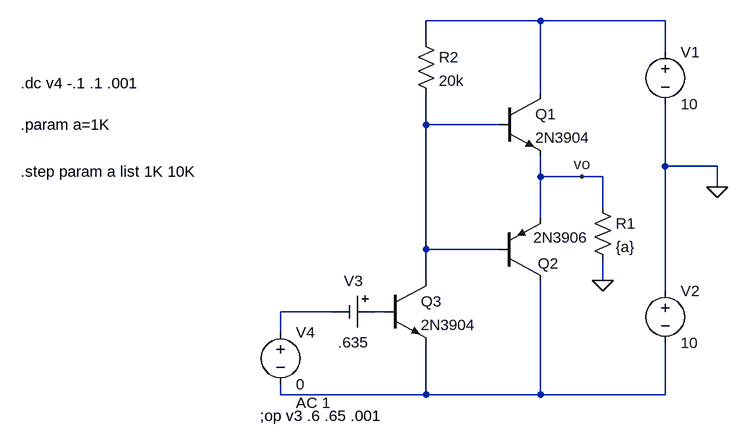
[diagram p0: schematic teoria7.asc]
teoria7.asc, the LTspice schematic file:
Version 4
SHEET 1 1092 680
WIRE 256 -32 80 -32
WIRE 448 -32 256 -32
WIRE 80 0 80 -32
WIRE 448 16 448 -32
WIRE 256 80 256 -32
WIRE 80 128 80 80
WIRE 192 128 80 128
WIRE 448 192 448 96
WIRE 528 192 448 192
WIRE 256 208 256 176
WIRE 320 208 256 208
WIRE 352 208 320 208
WIRE 528 224 528 192
WIRE 352 256 352 208
WIRE 256 272 256 208
WIRE 80 320 80 128
WIRE 192 320 80 320
WIRE 80 368 80 320
WIRE 352 368 352 336
WIRE 448 384 448 192
WIRE -64 416 -144 416
WIRE 16 416 0 416
WIRE -144 448 -144 416
WIRE -144 544 -144 528
WIRE 80 544 80 464
WIRE 80 544 -144 544
WIRE 256 544 256 368
WIRE 256 544 80 544
WIRE 448 544 448 464
WIRE 448 544 256 544
FLAG 352 368 0
FLAG 528 224 0
FLAG 320 208 vo
DATAFLAG 352 208 ""
DATAFLAG 80 224 ""
SYMBOL npn 192 80 R0
SYMATTR InstName Q1
SYMATTR Value 2N3904
SYMBOL pnp 192 368 M180
WINDOW 0 60 26 Left 2
WINDOW 3 53 66 Left 2
SYMATTR InstName Q2
SYMATTR Value 2N3906
SYMBOL voltage 448 0 R0
WINDOW 123 0 0 Left 0
WINDOW 39 0 0 Left 0
SYMATTR InstName V1
SYMATTR Value 10
SYMBOL voltage 448 368 R0
WINDOW 123 0 0 Left 0
WINDOW 39 0 0 Left 0
SYMATTR InstName V2
SYMATTR Value 10
SYMBOL res 336 240 R0
SYMATTR InstName R1
SYMATTR Value {a}
SYMBOL npn 16 368 R0
SYMATTR InstName Q3
SYMATTR Value 2N3904
SYMBOL Misc\\cell 0 416 R90
WINDOW 0 -32 32 VBottom 2
WINDOW 3 32 32 VTop 2
WINDOW 123 0 0 Left 0
WINDOW 39 0 0 Left 0
SYMATTR InstName V3
SYMATTR Value .635
SYMBOL voltage -144 432 R0
WINDOW 123 24 124 Left 2
WINDOW 39 0 0 Left 0
SYMATTR Value2 AC 1
SYMATTR InstName V4
SYMATTR Value 0
SYMBOL res 64 -16 R0
SYMATTR InstName R2
SYMATTR Value 20k
TEXT -176 576 Left 2 !;op v3 .6 .65 .001
TEXT -544 64 Left 2 !.dc v4 -.1 .1 .001
TEXT -544 128 Left 2 !.param a=1K
TEXT -544 200 Left 2 !.step param a list 1K 10K

The netlist it stands for:
* teoria7.asc
Q1 N001 N002 vo 0 2N3904
Q2 N005 N002 vo 0 2N3906
V1 N001 0 10
V2 0 N005 10
R1 vo 0 {a}
Q3 N002 N004 N005 0 2N3904
V3 N004 N003 .635
V4 N003 N005 0 AC 1
R2 N001 N002 20k
.model NPN NPN
.model PNP PNP
.lib standard.bjt
;op v3 .6 .65 .001
.dc v4 -.1 .1 .001
.param a=1K
.step param a list 1K 10K
.backanno
.end